# EAGLE design untitled (EAGLE 5.06)
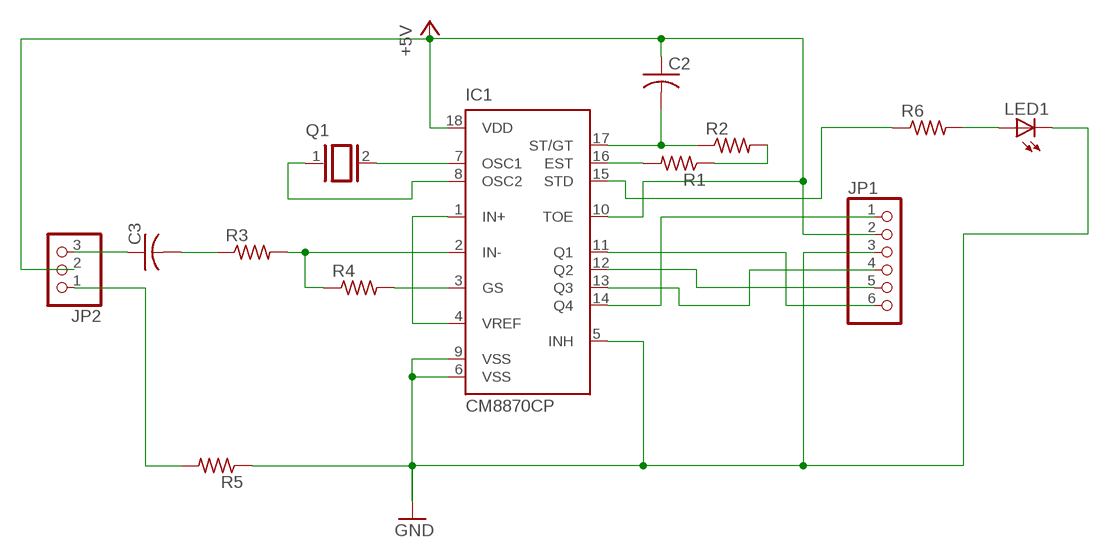
[diagram p0: schematic, sheet 1]

## Parts
C2  C-US025-025X050  [C025-025X050]
C3  C-US025-025X050  [C025-025X050]
IC1  CM8870CP  [DIL18]
JP1  PINHD-1X6  [1X06]
JP2  PINHD-1X3  [1X03]
LED1  LED3MM  [LED3MM]
Q1  XTAL/S  [QS]
R1  R-US_M1206  [M1206]
R2  R-US_M1206  [M1206]
R3  R-US_M1206  [M1206]
R4  R-US_M1206  [M1206]
R5  R-US_M1206  [M1206]
R6  R-US_M1206  [M1206]

## Nets
+5V: C2.1 IC1.10(TOE) IC1.18(VDD) JP1.2 JP2.2
GND: IC1.5(INH) IC1.6(VSS) IC1.9(VSS) JP1.3 LED1.K(C) R5.1
N$1: IC1.11(Q1) JP1.6
N$2: IC1.12(Q2) JP1.5
N$3: IC1.1(IN+) IC1.4(VREF)
N$4: C2.2 IC1.17(ST/GT) R2.1
N$5: R1.1 R2.2
N$6: IC1.16(EST) R1.2
N$7: IC1.2(IN-) R3.2 R4.1
N$8: IC1.3(GS) R4.2
N$9: IC1.13(Q3) JP1.4
N$10: C3.2 R3.1
N$11: C3.1 JP2.3
N$12: IC1.7(OSC1) Q1.2
N$13: IC1.8(OSC2) Q1.1
N$14: IC1.14(Q4) JP1.1
N$15: JP2.1 R5.2
N$16: LED1.A R6.2
N$17: IC1.15(STD) R6.1

## Library data of the parts
C2 C3 = rcl:C-US: CAPACITOR, American symbol
IC1 = california-micro-devices:CM8870C: CMOS Integrated DTMF Receiver cm8870.pdf
JP1 = pinhead:PINHD-1X6: PIN HEADER
JP2 = pinhead:PINHD-1X3: PIN HEADER
LED1 = led:LED: LED OSRAM: - CHIPLED LG R971, LG N971, LY N971, LG Q971, LY Q971, LO R971, LY R971 LH N974, LH R974 LS Q976, LO Q976, LY Q976 LO Q996 - Hyper CHIPLED LW Q18S LB Q993, LB Q99A, LB R99A - SideLED LS A670, LO A670, LY A670, LG A670, LP A670 LB A673, LV A673, LT A673, LW A673 LH A674 LY A675 LS A676, LA A676, LO A676, LY A676, LW A676 LS A679, LY A679, LG A679 - Hyper Micro SIDELED® LS Y876, LA Y876, LO Y876, LY Y876 LT Y87S - SmartLED LW L88C, LW L88S LB L89C, LB L89S, LG L890 LS L89K, LO L89K, LY L89K LS L896, LA L896, LO L896, LY L896 - TOPLED LS T670, LO T670, LY T670, LG T670, LP T670 LSG T670, LSP T670, LSY T670, LOP T670, LYG T670 LG T671, LOG T671, LSG T671 LB T673, LV T673, LT T673, LW T673 LH T674 LS T676, LA T676, LO T676, LY T676, LB T676, LH T676, LSB T676, LW T676 LB T67C, LV T67C, LT T67C, LS T67K, LO T67K, LY T67K, LW E67C LS E67B, LA E67B, LO E67B, LY E67B, LB E67C, LV E67C, LT E67C LW T67C LS T679, LY T679, LG T679 LS T770, LO T770, LY T770, LG T770, LP T770 LB T773, LV T773, LT T773, LW T773 LH T774 LS E675, LA E675, LY E675, LS T675 LS T776, LA T776, LO T776, LY T776, LB T776 LHGB T686 LT T68C, LB T68C - Hyper Mini TOPLED® LB M676 - Mini TOPLED Santana® LG M470 LS M47K, LO M47K, LY M47K Source: http://www.osram.convergy.de LUXEON: - LUMILED® LXK2-PW12-R00, LXK2-PW12-S00, LXK2-PW14-U00, LXK2-PW14-V00 LXK2-PM12-R00, LXK2-PM12-S00, LXK2-PM14-U00 LXK2-PE12-Q00, LXK2-PE12-R00, LXK2-PE12-S00, LXK2-PE14-T00, LXK2-PE14-U00 LXK2-PB12-K00, LXK2-PB12-L00, LXK2-PB12-M00, LXK2-PB14-N00, LXK2-PB14-P00, LXK2-PB14-Q00 LXK2-PR12-L00, LXK2-PR12-M00, LXK2-PR14-Q00, LXK2-PR14-R00 LXK2-PD12-Q00, LXK2-PD12-R00, LXK2-PD12-S00 LXK2-PH12-R00, LXK2-PH12-S00 LXK2-PL12-P00, LXK2-PL12-Q00, LXK2-PL12-R00 Source: www.luxeon.com KINGBRIGHT: KA-3528ASYC Source: www.kingbright.com
Q1 = special:XTAL/S: CRYSTAL
R1-R6 = rcl:R-US_: RESISTOR, American symbol

## Board
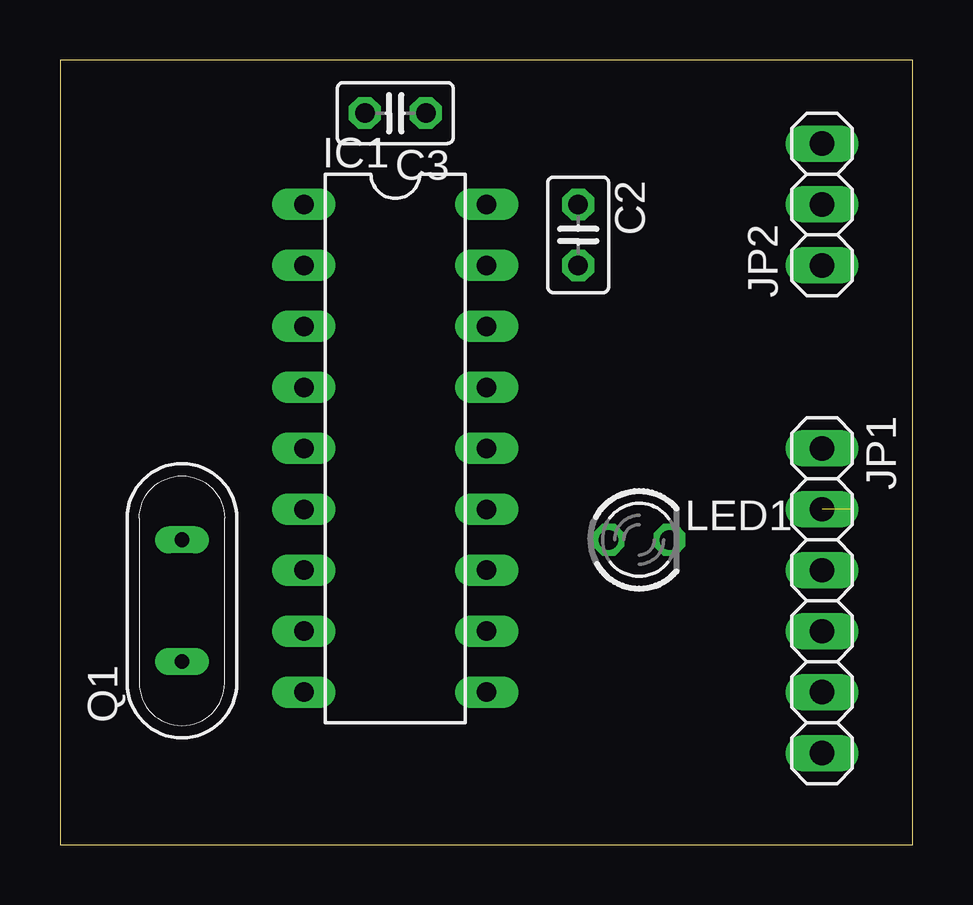
[diagram p1: board, top side]
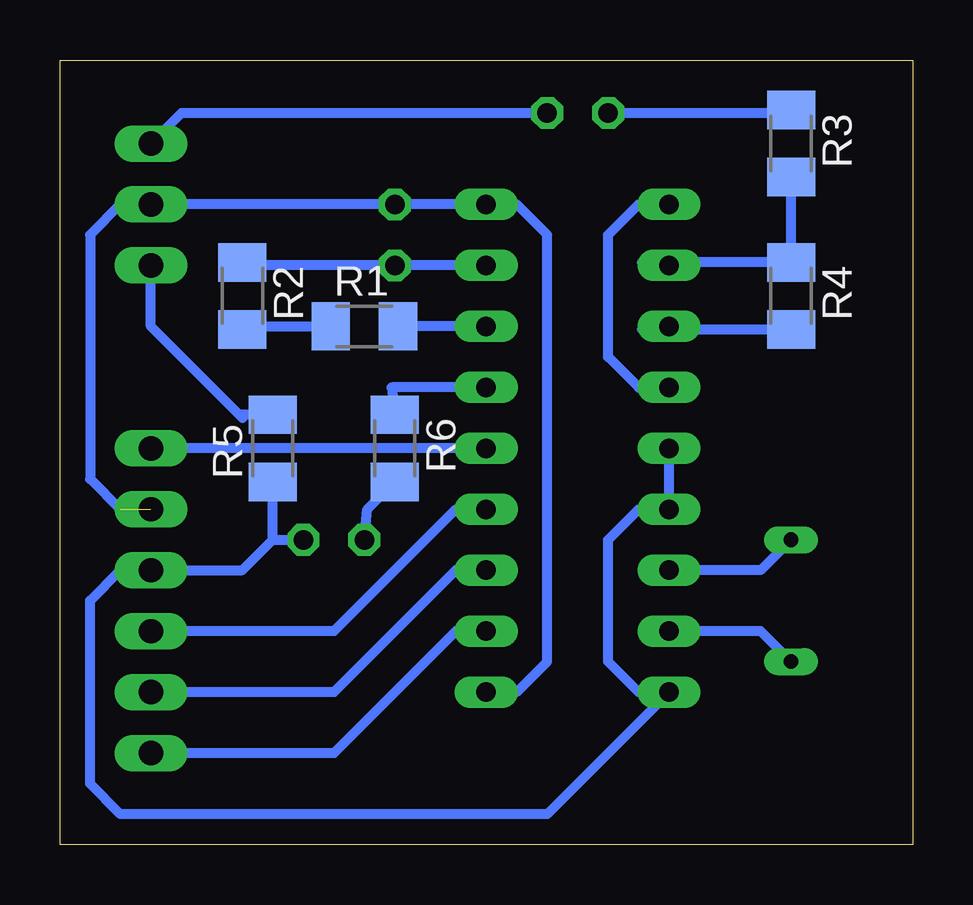
[diagram p2: board, bottom side, seen from below]

Size 35.54 x 32.69 mm. Coordinates in mm from the lower left corner, seen from the top.
Outline: 0,0 35.54,0 35.54,32.69 0,32.69 0,0
Copper layers (1*16): Top 0.035mm / dielectric 1.5mm / Bottom 0.035mm
Design rules "default": minimum track width 10mil, minimum drill 24mil, track to track 8mil, track to pad 8mil, pad to pad 8mil, via to via 8mil, smd to smd 8mil, copper to edge 40mil, drill to drill 8mil, minimum pad ring 10mil, minimum via ring 8mil, stop-mask expansion 4mil, vias tented up to drill 0mil, thermal gap 10mil

### Footprints (pad centres in the part's own frame; a part is rotated, then mirrored left to right if it is on the bottom)
C025-025X050 = drill 0.813 octagon: 1 -1.27,0; 2 1.27,0
DIL18 = drill 0.813 long: 1 -10.16,-3.81; 2 -7.62,-3.81; 3 -5.08,-3.81; 4 -2.54,-3.81; 5 0,-3.81; 6 2.54,-3.81; 7 5.08,-3.81; 8 7.62,-3.81; 9 10.16,-3.81; 10 10.16,3.81; 11 7.62,3.81; 12 5.08,3.81; 13 2.54,3.81; 14 0,3.81; 15 -2.54,3.81; 16 -5.08,3.81; 17 -7.62,3.81; 18 -10.16,3.81
1X06 = drill 1.016 long: 1 -6.35,0; 2 -3.81,0; 3 -1.27,0; 4 1.27,0; 5 3.81,0; 6 6.35,0
1X03 = drill 1.016 long: 1 -2.54,0; 2 0,0; 3 2.54,0
LED3MM = drill 0.813 octagon: A -1.27,0; K 1.27,0
QS = drill 0.61 long: 1 -2.54,0; 2 2.54,0
M1206 = smd 1.6 x 2: 1 -1.4,0; 2 1.4,0

### Placement (x,y rotation side)
C2  21.59,25.4 270 top
C3  13.97,30.48 180 top
IC1  13.97,16.51 270 top
JP1  31.75,10.16 270 top
JP2  31.75,26.67 90 top
LED1  24.13,12.7 0 top
Q1  5.08,10.16 90 top
R1  22.86,21.59 0 bottom
R2  27.94,22.86 270 bottom
R3  5.08,29.21 270 bottom
R4  5.08,22.86 270 bottom
R5  26.67,16.51 90 bottom
R6  21.59,16.51 270 bottom

### Tracks (layer width: path | path; a pad name or v marks a point on that pad's centre or on a via)
+5V  (1 unrouted)
  Bottom 0.406: 33.02,13.97 34.29,15.24 34.29,25.4 33.02,26.67 JP2.2 C2.1 IC1.18 16.51,26.67 15.24,25.4 15.24,7.62 16.51,6.35 IC1.10
GND
  Bottom 0.406: IC1.5 IC1.6 11.43,13.97 12.7,12.7 12.7,7.62 11.43,6.35 IC1.9 15.24,1.27 33.02,1.27 34.29,2.54 34.29,10.16 33.02,11.43 JP1.3 27.94,11.43 26.67,12.7 | 26.67,12.7 R5.1 | 26.67,12.7 LED1.K
N$1
  Bottom 0.406: IC1.11 19.05,8.89 24.13,3.81 JP1.6
N$2
  Bottom 0.406: IC1.12 19.05,11.43 24.13,6.35 JP1.5
N$3
  Bottom 0.406: IC1.1 11.43,26.67 12.7,25.4 12.7,20.32 11.43,19.05 IC1.4
N$4
  Bottom 0.406: IC1.17 C2.2 27.94,24.13 R2.1
N$5
  Bottom 0.406: 27.81,21.46 R2.2 27.81,21.59 R1.1
N$6
  Bottom 0.406: IC1.16 R1.2
N$7
  Bottom 0.406: IC1.2 11.3,24.26 R4.1 R3.2
N$8
  Bottom 0.406: R4.2 11.3,21.46 IC1.3
N$9
  Bottom 0.406: IC1.13 19.05,13.97 24.13,8.89 JP1.4
N$10
  Bottom 0.406: C3.2 5.21,30.48 R3.1
N$11
  Bottom 0.406: C3.1 30.48,30.48 JP2.3
N$12
  Bottom 0.406: IC1.7 6.35,11.43 Q1.2
N$13
  Bottom 0.406: IC1.8 6.35,8.89 Q1.1
N$14
  Bottom 0.406: IC1.14 JP1.1
N$15
  Bottom 0.406: JP2.1 31.75,21.59 28.07,17.91 | 28.07,17.91 27.94,17.78 | R5.2 28.07,17.91
N$16
  Bottom 0.406: 21.46,15.11 R6.2 22.73,13.97 LED1.A
N$17
  Bottom 0.406: IC1.15 21.72,19.05 R6.1